# Altium schematic sheet BLUELED.SchDoc
size A
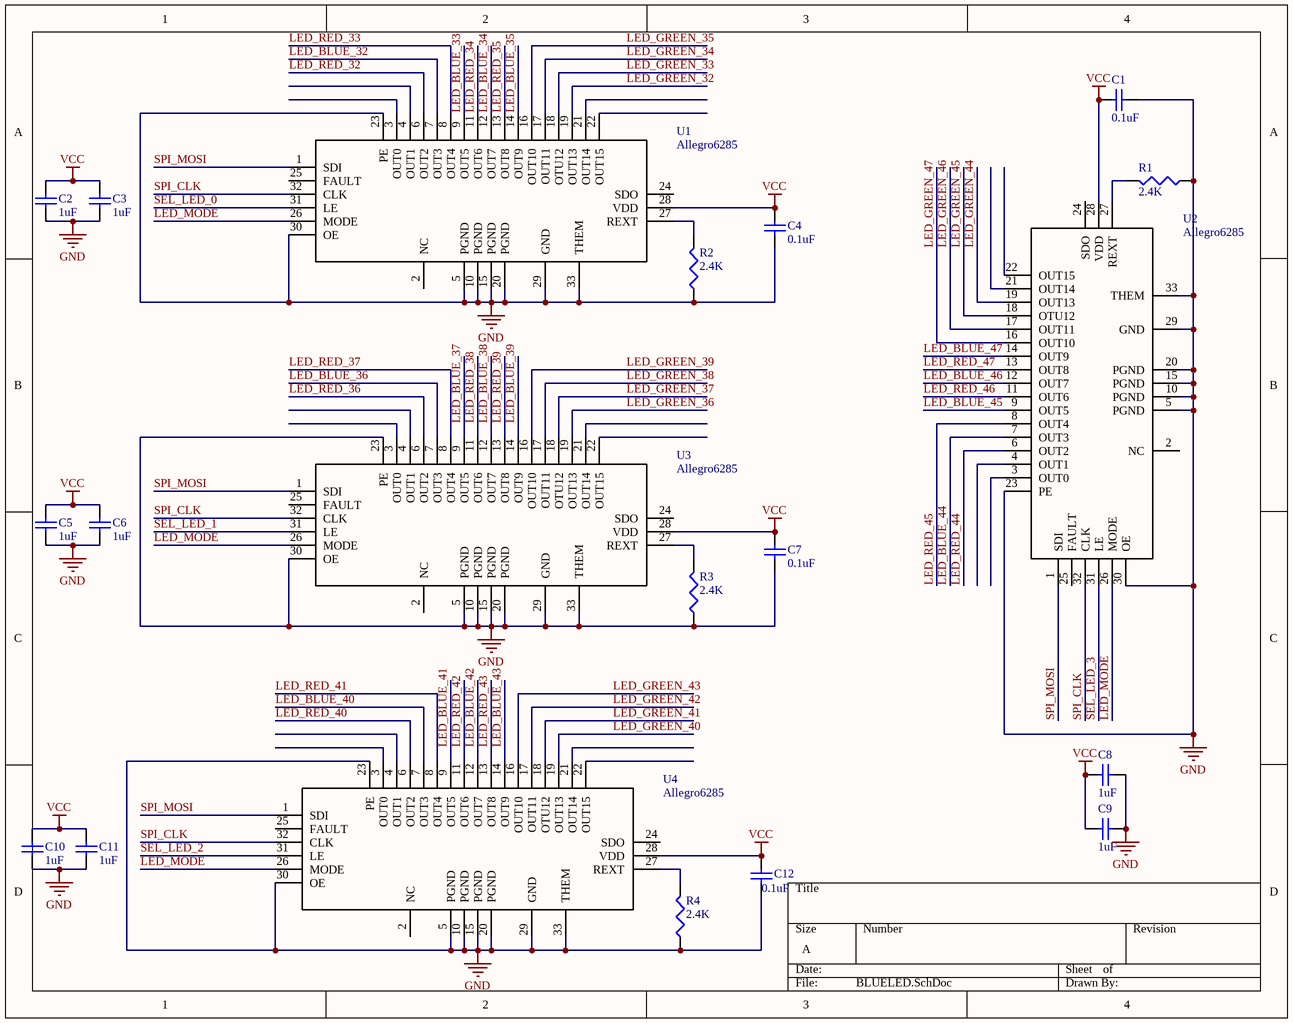
[diagram p0: BLUELED.SchDoc]

## Parts
C1  value 0.1uF  [CAPC1005L]  (hidden comment: Cap Semi)
C2  value 1uF  [CAPC1608L]  (hidden comment: Cap Semi)
C3  value 1uF  [CAPC1608L]  (hidden comment: Cap Semi)
C4  value 0.1uF  [CAPC1005L]  (hidden comment: Cap Semi)
C5  value 1uF  [CAPC1608L]  (hidden comment: Cap Semi)
C6  value 1uF  [CAPC1608L]  (hidden comment: Cap Semi)
C7  value 0.1uF  [CAPC1005L]  (hidden comment: Cap Semi)
C8  value 1uF  [CAPC1608L]  (hidden comment: Cap Semi)
C9  value 1uF  [CAPC1608L]  (hidden comment: Cap Semi)
C10  value 1uF  [CAPC1608L]  (hidden comment: Cap Semi)
C11  value 1uF  [CAPC1608L]  (hidden comment: Cap Semi)
C12  value 0.1uF  [CAPC1005L]  (hidden comment: Cap Semi)
R1  value 2.4K  [RESC1608L]  (hidden comment: Res3)
R2  value 2.4K  [RESC1608L]  (hidden comment: Res3)
R3  value 2.4K  [RESC1608L]  (hidden comment: Res3)
R4  value 2.4K  [RESC1608L]  (hidden comment: Res3)
U1  Allegro6285  [QFN-32]
U2  Allegro6285  [QFN-32]
U3  Allegro6285  [QFN-32]
U4  Allegro6285  [QFN-32]

## Nets
GND: C1.1 C2.1 C3.1 C4.1 C5.1 C6.1 C7.1 C8.1 C9.1 C10.1 C11.1 C12.1 R1.1 R2.1 R3.1 R4.1 U1.5(PGND) U1.10(PGND) U1.15(PGND) U1.20(PGND) U1.23(PE) U1.29(GND) U1.30(OE) U1.33(THEM) U2.5(PGND) U2.10(PGND) U2.15(PGND) U2.20(PGND) U2.23(PE) U2.29(GND) U2.30(OE) U2.33(THEM) U3.5(PGND) U3.10(PGND) U3.15(PGND) U3.20(PGND) U3.23(PE) U3.29(GND) U3.30(OE) U3.33(THEM) U4.5(PGND) U4.10(PGND) U4.15(PGND) U4.20(PGND) U4.23(PE) U4.29(GND) U4.30(OE) U4.33(THEM)
VCC: C1.2 C2.2 C3.2 C4.2 C5.2 C6.2 C7.2 C8.2 C9.2 C10.2 C11.2 C12.2 U1.28(VDD) U2.28(VDD) U3.28(VDD) U4.28(VDD)
LED_BLUE_32: U1.7(OUT3)
LED_BLUE_33: U1.9(OUT5)
LED_BLUE_34: U1.12(OUT7)
LED_BLUE_35: U1.14(OUT9)
LED_BLUE_36: U3.7(OUT3)
LED_BLUE_37: U3.9(OUT5)
LED_BLUE_38: U3.12(OUT7)
LED_BLUE_39: U3.14(OUT9)
LED_BLUE_40: U4.7(OUT3)
LED_BLUE_41: U4.9(OUT5)
LED_BLUE_42: U4.12(OUT7)
LED_BLUE_43: U4.14(OUT9)
LED_BLUE_44: U2.7(OUT3)
LED_BLUE_45: U2.9(OUT5)
LED_BLUE_46: U2.12(OUT7)
LED_BLUE_47: U2.14(OUT9)
LED_GREEN_32: U1.19(OUT13)
LED_GREEN_33: U1.18(OTU12)
LED_GREEN_34: U1.17(OUT11)
LED_GREEN_35: U1.16(OUT10)
LED_GREEN_36: U3.19(OUT13)
LED_GREEN_37: U3.18(OTU12)
LED_GREEN_38: U3.17(OUT11)
LED_GREEN_39: U3.16(OUT10)
LED_GREEN_40: U4.19(OUT13)
LED_GREEN_41: U4.18(OTU12)
LED_GREEN_42: U4.17(OUT11)
LED_GREEN_43: U4.16(OUT10)
LED_GREEN_44: U2.19(OUT13)
LED_GREEN_45: U2.18(OTU12)
LED_GREEN_46: U2.17(OUT11)
LED_GREEN_47: U2.16(OUT10)
LED_MODE: U1.26(MODE) U2.26(MODE) U3.26(MODE) U4.26(MODE)
LED_RED_32: U1.6(OUT2)
LED_RED_33: U1.8(OUT4)
LED_RED_34: U1.11(OUT6)
LED_RED_35: U1.13(OUT8)
LED_RED_36: U3.6(OUT2)
LED_RED_37: U3.8(OUT4)
LED_RED_38: U3.11(OUT6)
LED_RED_39: U3.13(OUT8)
LED_RED_40: U4.6(OUT2)
LED_RED_41: U4.8(OUT4)
LED_RED_42: U4.11(OUT6)
LED_RED_43: U4.13(OUT8)
LED_RED_44: U2.6(OUT2)
LED_RED_45: U2.8(OUT4)
LED_RED_46: U2.11(OUT6)
LED_RED_47: U2.13(OUT8)
SEL_LED_0: U1.31(LE)
SEL_LED_1: U3.31(LE)
SEL_LED_2: U4.31(LE)
SEL_LED_3: U2.31(LE)
SPI_CLK: U1.32(CLK) U2.32(CLK) U3.32(CLK) U4.32(CLK)
SPI_MOSI: U1.1(SDI) U2.1(SDI) U3.1(SDI) U4.1(SDI)
NetR1_2: R1.2 U2.27(REXT)
NetR2_2: R2.2 U1.27(REXT)
NetR3_2: R3.2 U3.27(REXT)
NetR4_2: R4.2 U4.27(REXT)

Not connected (* = marked no-connect by the designer): U1 2(NC) 3(OUT0) 4(OUT1) 21(OUT14) 22(OUT15) 24(SDO) 25(FAULT); U2 2(NC) 3(OUT0) 4(OUT1) 21(OUT14) 22(OUT15) 24(SDO) 25(FAULT); U3 2(NC) 3(OUT0) 4(OUT1) 21(OUT14) 22(OUT15) 24(SDO) 25(FAULT); U4 2(NC) 3(OUT0) 4(OUT1) 21(OUT14) 22(OUT15) 24(SDO) 25(FAULT)

## Library data of the parts
C1-C12 = Cap Semi: Capacitor (Semiconductor SIM Model); Published: 8-Jun-2000; LatestRevisionDate: 29-May-2009; LatestRevisionNote: IPC-7351 Footprint Added.; PackageReference: C1206; Publisher: Altium Limited; PackageDescription: Chip Capacitor
R1-R4 = Res3: Resistor; Published: 8-Jun-2000; LatestRevisionDate: 29-May-2009; LatestRevisionNote: IPC-7351 Footprint Added.; PackageReference: J1-0603; Publisher: Altium Limited; PackageDescription: Chip Resistor